# Altium schematic sheet Controller.SchDoc
size 297 x 209 mm; SheetNumber: 2; SheetTotal: 4
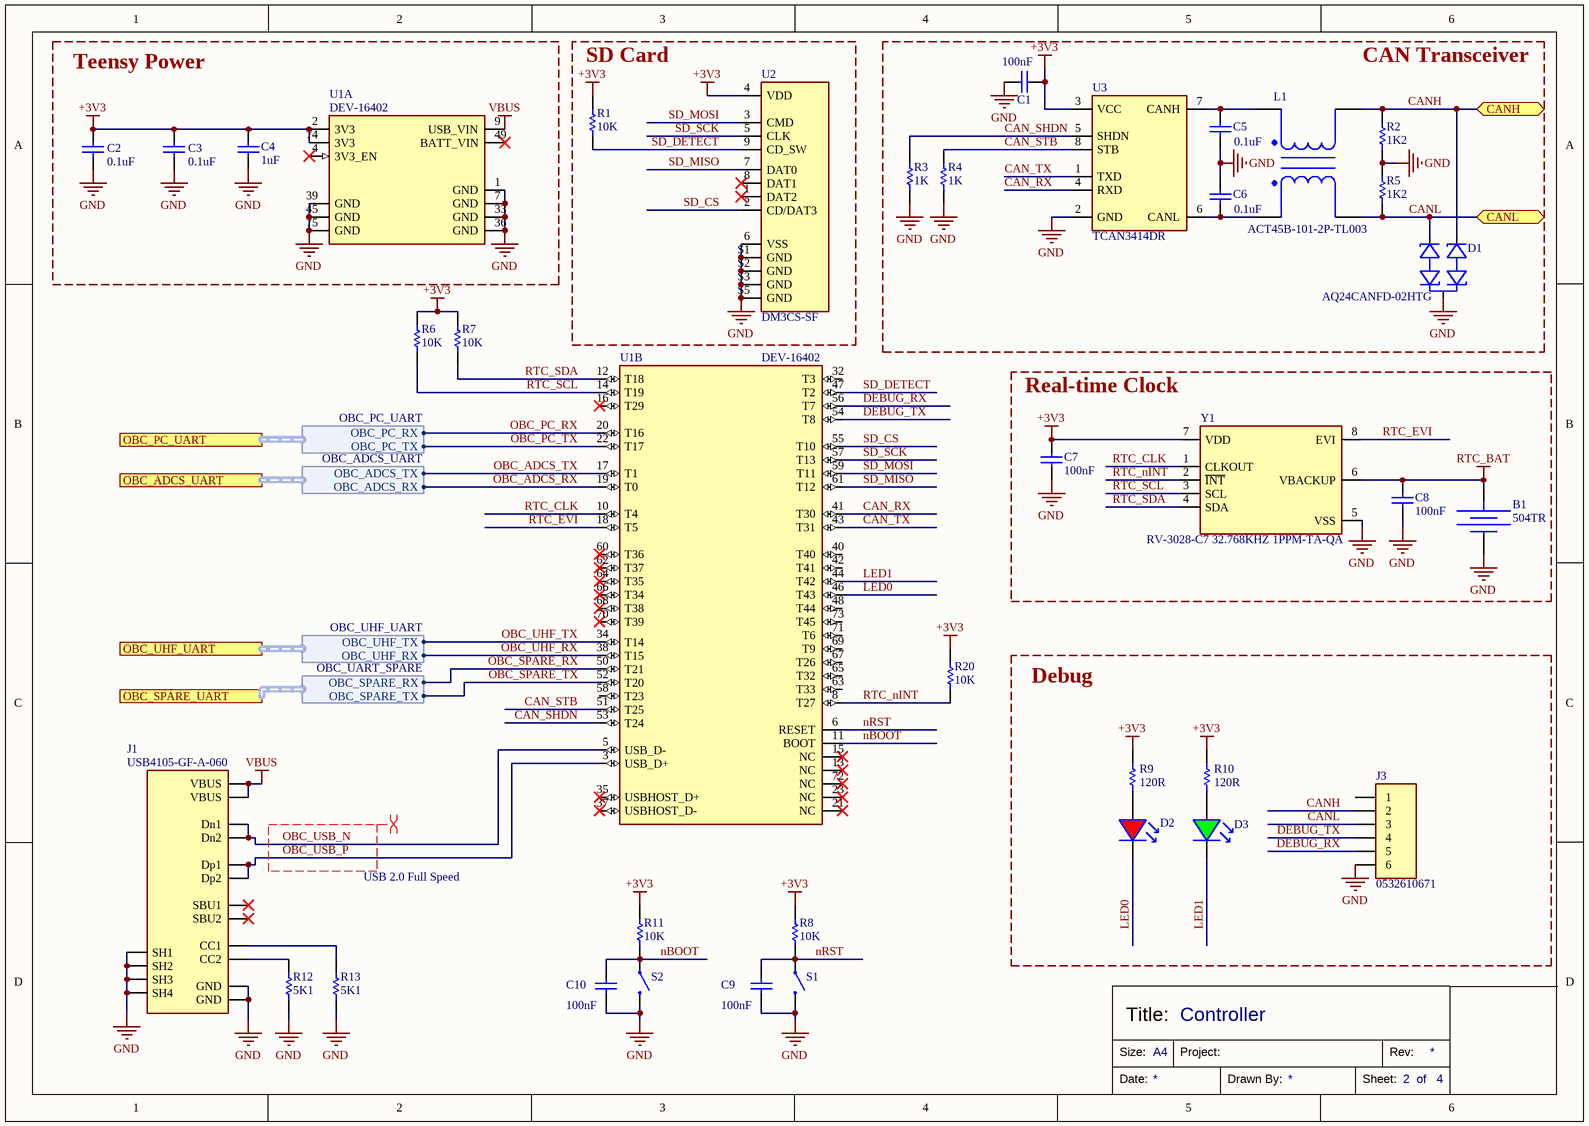
[diagram p0: Controller.SchDoc]

## Parts
B1  504TR  [504TR]
C1  Capacitance: 100nF  [CAPC0603X040]  (hidden comment: C0603C104K5RACTU)
C2  Capacitance: 0.1uF  [CAPC0402X020]  (hidden comment: CL05B104KB5NNNC)
C3  Capacitance: 0.1uF  [CAPC0402X020]  (hidden comment: CL05B104KB5NNNC)
C4  Capacitance: 1uF  [CAPC0805X060]  (hidden comment: CL21B105KAFNNNE)
C5  Capacitance: 0.1uF  [CAPC0402X020]  (hidden comment: CL05B104KB5NNNC)
C6  Capacitance: 0.1uF  [CAPC0402X020]  (hidden comment: CL05B104KB5NNNC)
C7  Capacitance: 100nF  [CAPC0603X040]  (hidden comment: C0603C104K5RACTU)
C8  Capacitance: 100nF  [CAPC0603X040]  (hidden comment: C0603C104K5RACTU)
C9  Capacitance: 100nF  [CAPC0603X040]  (hidden comment: C0603C104K5RACTU)
C10  Capacitance: 100nF  [CAPC0603X040]  (hidden comment: C0603C104K5RACTU)
D1  AQ24CANFD-02HTG  [SOT23-3 IC]
D2  LTST-C171KRKT  [LEDR_0805]  (value not drawn)
D3  LTST-C171KGKT  [LEDG_0805]  (value not drawn)
J1  USB4105-GF-A-060  [USB4105-GF-A-060]
J3  0532610671  [0532610671]
L1  ACT45B-101-2P-TL003  [ACT45B-101-2P-TL003]
R1  Resistance: 10K  [RESC0805]  (hidden comment: RMCF0805FT10K0)
R2  Resistance: 1K2  [RESC0603]  (hidden comment: RMCF0603FT1K20)
R3  Resistance: 1K  [RESC0805]  (hidden comment: RNCP0805FTD1K00)
R4  Resistance: 1K  [RESC0805]  (hidden comment: RNCP0805FTD1K00)
R5  Resistance: 1K2  [RESC0603]  (hidden comment: RMCF0603FT1K20)
R6  Resistance: 10K  [RESC0603]  (hidden comment: RMCF0603FT10K0)
R7  Resistance: 10K  [RESC0603]  (hidden comment: RMCF0603FT10K0)
R8  Resistance: 10K  [RESC0805]  (hidden comment: RMCF0805FT10K0)
R9  Resistance: 120R  [RESC0805]  (hidden comment: RMCF0805FT120R)
R10  Resistance: 120R  [RESC0805]  (hidden comment: RMCF0805FT120R)
R11  Resistance: 10K  [RESC0805]  (hidden comment: RMCF0805FT10K0)
R12  Resistance: 5K1  [RESC0603]  (hidden comment: RMCF0603FT5K10)
R13  Resistance: 5K1  [RESC0603]  (hidden comment: RMCF0603FT5K10)
R20  Resistance: 10K  [RESC0603]  (hidden comment: RMCF0603FT10K0)
S1  B3U-1000P  [B3U-1000P]  (value not drawn)
S2  B3U-1000P  [B3U-1000P]  (value not drawn)
U1  DEV-16402  [DEV-16402]  (parts A,B of 2)
U2  DM3CS-SF  [DM3CS-SF]
U3  TCAN3414DR  [SOIC-8]
Y1  RV-3028-C7 32.768KHZ 1PPM-TA-QA  [RV-3028]

## Blocks framed on the sheet
Teensy Power: C2-C4 U1
SD Card: R1 U2
CAN Transceiver: C1 C5 C6 D1 L1 R2-R5 U3
Real-time Clock: B1 C7 C8 Y1
Debug: D2 D3 J3 R9 R10

## Ports
CANH (bidir, see PC104[1B]), CANL (bidir, see PC104[1B]), OBC_ADCS_UART (harness OBC_ADCS_UART, see PC104[1B]), OBC_PC_UART (harness OBC_PC_UART, see PC104[4B]), OBC_SPARE_UART (harness OBC_UART_SPARE, see PC104[4A]), OBC_UHF_UART (harness OBC_UHF_UART, see PC104[1C])

## Harnesses
OBC_ADCS_UART: OBC_ADCS_TX, OBC_ADCS_RX
OBC_PC_UART: OBC_PC_TX, OBC_PC_RX
OBC_UHF_UART: OBC_UHF_TX, OBC_UHF_RX
OBC_UART_SPARE: OBC_SPARE_TX, OBC_SPARE_RX

## Nets
+3V3: C1.2 C2.2 C3.2 C4.2 C7.2 R1.2 R6.2 R7.2 R8.2 R9.2 R10.2 R11.2 R20.2 U1.2(3V3) U1.74(3V3) U2.4(VDD) U3.3(VCC) Y1.7(VDD)
GND: B1.2 C1.1 C2.1 C3.1 C4.1 C5.1 C6.2 C7.1 C8.1 C9.1 C10.1 D1.3 J1.A1_B12(GND) J1.B1_A12(GND) J1.SH1 J1.SH2 J1.SH3 J1.SH4 J3.6 R2.1 R3.1 R4.1 R5.2 R12.1 R13.1 S1.2 S2.2 U1.1(GND) U1.7(GND) U1.33(GND) U1.36(GND) U1.39(GND) U1.45(GND) U1.75(GND) U2.6(VSS) U2.S1(GND) U2.S2(GND) U2.S3(GND) U2.S5(GND) U3.2(GND) Y1.5(VSS)
RTC_BAT: B1.1 C8.2 Y1.6(VBACKUP)
VBUS: J1.A4_B9(VBUS) J1.B4_A9(VBUS) U1.9(USB_VIN)
CAN_RX: U1.41(T30) U3.4(RXD)
CAN_SHDN: R3.2 U1.53(T24) U3.5(SHDN)
CAN_STB: R4.2 U1.51(T25) U3.8(STB)
CAN_TX: U1.43(T31) U3.1(TXD)
CANH: D1.1 J3.2 L1.4 R2.2 ; port CANH
CANL: D1.2 J3.3 L1.3 R5.1 ; port CANL
DEBUG_RX: J3.5 U1.56(T7)
DEBUG_TX: J3.4 U1.54(T8)
LED0: D2.K U1.46(T43)
LED1: D3.K U1.44(T42)
nBOOT: C10.2 R11.1 S2.1 U1.11(BOOT)
nRST: C9.2 R8.1 S1.1 U1.6(RESET)
OBC_ADCS_RX: U1.19(T0) ; port OBC_ADCS_UART.OBC_ADCS_RX
OBC_ADCS_TX: U1.17(T1) ; port OBC_ADCS_UART.OBC_ADCS_TX
OBC_PC_RX: U1.20(T16) ; port OBC_PC_UART.OBC_PC_RX
OBC_PC_TX: U1.22(T17) ; port OBC_PC_UART.OBC_PC_TX
OBC_SPARE_RX: U1.50(T21) ; port OBC_SPARE_UART.OBC_SPARE_RX
OBC_SPARE_TX: U1.52(T20) ; port OBC_SPARE_UART.OBC_SPARE_TX
OBC_UHF_RX: U1.38(T15) ; port OBC_UHF_UART.OBC_UHF_RX
OBC_UHF_TX: U1.34(T14) ; port OBC_UHF_UART.OBC_UHF_TX
OBC_USB_N: J1.A7(Dn1) J1.B7(Dn2) U1.5(USB_D-)
OBC_USB_P: J1.A6(Dp1) J1.B6(Dp2) U1.3(USB_D+)
RTC_CLK: U1.10(T4) Y1.1(CLKOUT)
RTC_EVI: U1.18(T5) Y1.8(EVI)
RTC_nINT: R20.1 U1.8(T27) Y1.2(~{INT})
RTC_SCL: R6.1 U1.14(T19) Y1.3(SCL)
RTC_SDA: R7.1 U1.12(T18) Y1.4(SDA)
SD_CS: U1.55(T10) U2.2(CD/DAT3)
SD_DETECT: R1.1 U1.47(T2) U2.9(CD_SW)
SD_MISO: U1.61(T12) U2.7(DAT0)
SD_MOSI: U1.59(T11) U2.3(CMD)
SD_SCK: U1.57(T13) U2.5(CLK)
NetC5_2: C5.2 L1.1 U3.7(CANH)
NetC6_1: C6.1 L1.2 U3.6(CANL)
NetD2_A: D2.A R9.1
NetD3_A: D3.A R10.1
NetJ1_A5: J1.A5(CC1) R13.2
NetJ1_B5: J1.B5(CC2) R12.2

Not connected (* = marked no-connect by the designer): J1 A8(SBU1)* B8(SBU2)*; J3 1; U1 4(3V3_EN)* 13(NC)* 15(NC)* 16(T29)* 21(NC)* 23(NC)* 32(T3) 35(USBHOST_D+)* 37(USBHOST_D-)* 40(T40) 42(T41) 48(T44) 49(BATT_VIN)* 58(T23) 60(T36)* 62(T37)* 63(T33) 64(T35)* 65(T32) 66(T34)* 67(T26) 68(T38)* 69(T9) 70(T39)* 71(T6) 72(NC)* 73(T45); U2 1(DAT2)* 8(DAT1)*

## Layout directives
differential pair: OBC_USB_N, OBC_USB_P

## Notes on the sheet
- (near J1) USB 2.0 Full Speed
- Controller
- Size:
- Title:
- A4
- Project:
- Rev:
- Date:
- Drawn By:
- Sheet:
- of

## Library data of the parts
B1 = 504TR: Battery Holder (Open) Coin, 16.0mm 1 Cell SMD (SMT) Tab; Base Material: LCP UL94V-0; Battery Reference: ML621; Part Number: 504TR; Distributor Part Number: 36-504CT-ND; Operating Temperature: -50C to 145C
C1 C7-C10 = C0603C104K5RACTU: 0.1 µF ±10% 50V Ceramic Capacitor X7R 0603 (1608 Metric); Tolerance: 10%; Distributor Part Number: 399-C0603C104K5RACTUCT-ND; Case Code: 0603; Voltage Rating: 50V; Distributor: Digikey; Part Number: C0603C104K5RACTU
C2 C3 C5 C6 = CL05B104KB5NNNC: 0.1 µF ±10% 50V Ceramic Capacitor X7R 0402 (1005 Metric); Part Number: CL05B104KB5NNNC; Tolerance: 10%; Distributor Part Number: 1276-CL05B104KB5NNNCCT-ND; Case Code: 0402; Distributor: Digikey; Voltage Rating: 50V
C4 = CL21B105KAFNNNE: 1uF ±10% 25V Ceramic Capacitor X7R 0805 (2012 Metric); Part Number: CL21B105KAFNNNE; Distributor Part Number: 1276-1066-1-ND; Tolerance: 10%; Case Code: 0805; Distributor: Digikey; Voltage Rating: 25V
D1 = AQ24CANFD-02HTG: 50V Clamp 3A (8/20µs) Ipp Tvs Diode Surface Mount SOT-23-3; Qualification: AEC-Q101; Voltage - Reverse Standoff (Typ): 24V; Voltage - Breakdown (Min): 26.7V; Power - Peak Pulse: 200W; Capacitance: 11.5pF @ 1MHz; Part Number: AQ24CANFD-02HTG; Distributor Part Number: F10993CT-ND; Distributor: Digikey; Operating Temperature: -40°C ~ 150°C; Voltage - Clamping (Max): 50V; Current - Peak Pulse (10us/1000us): 3A
D2 = LTST-C171KRKT: Red 631nm LED Indication - Discrete 2V 0805 (2012 Metric); Distributor Part Number: 160-1427-1-ND; Colour: Red; Operating Temperature: -30℃~+85℃; Distributor: Digikey; Part Number: LTST-C171KRKT
D3 = KT-0805G: LED Green 0805 00mW 120° 2.6V~3.1V 430mcd 513nm~528nm 525nm 5mA; Distributor Part Number: 160-1426-1-ND; Colour: Green; Operating Temperature: -40℃~+85℃; Distributor: Digikey; Part Number: LTST-C171KGKT
J1 = USB4105-GF-A-060: USB-C (USB TYPE-C) USB 2.0 Receptacle Connector 24 (16+8 Dummy) Position Surface Mount, Right Angle; Through Hole; Specifications: USB 2.0; Voltage Rating: 48VDC; Current Rating: 5A; Part Number: USB4105-GF-A-060; Distributor: Digikey; Distributor Part Number: 2073-USB4105-GF-A-060CT-ND; Operating Temperature: -40C ~ 85C
J3 = 0532610671: Connector Header Surface Mount, Right Angle 6 position 0.049" (1.25mm) Picoblade; Number of Positions: 6; Contact Current (Max): 1A; Material Flammability Rating: UL94 V-0; Part Number: 0532610671; Distributor Part Number: WM7624CT-ND; Distributor: Digikey
L1 = ACT45B-101-2P-TL003: Common Mode Choke 100 µH @ 100 kHz 2 Line Surface Mount 5.8 kOhms @ 10 MHz 150mA DCR 2Ohm; Inductance: 100uH @ 100kHz; Voltage Rating (DC): 50V; Qualification: AEC-Q200; Part Number: ACT45B-101-2P-TL003; Distributor: Digikey; Distributor Part Number: 445-3959-1-ND; Impedance: 5.8kohms @ 10MHz; Current Rating (Max): 150mA; DCR: 2Ohm; Operating Temperature: -40°C ~ 150°C
R1 R8 R11 = RMCF0805FT10K0: 10 kOhms ±1% 0.125W, 1/8W Chip Resistor 0805 (2012 Metric) Automotive AEC-Q200 Thick Film; Tolerance: 1%; Distributor Part Number: RMCF0805FT10K0CT-ND; Case Code: 0805; Distributor: Digikey; Part Number: RMCF0805FT10K0
R2 R5 = RMCF0603FT1K20: 1.2 kOhms ±1% 0.1W, 1/10W Chip Resistor 0603 (1608 Metric) Automotive AEC-Q200 Thick Film; Part Number: RMCF0603FT1K20; Tolerance: 1%; Distributor: Digikey; Distributor Part Number: RMCF0603FT1K20CT-ND; Case Code: 0603
R3 R4 = RNCP0805FTD1K00: 1 kOhms ±1% 0.25W, 1/4W Chip Resistor 0805 (2012 Metric) Anti-Sulfur Thin Film; Manufacturer Part Number: RNCP0805FTD1K00; Tolerance: 1%; Distributor Part Number: RNCP0805FTD1K00CT-ND; Distributor: Digikey; Case Code: 0805
R6 R7 R20 = RMCF0603FT10K0: 10 kOhms ±1% 0.1W, 1/10W Chip Resistor 0603 (1608 Metric) Automotive AEC-Q200 Thick Film; Part Number: RMCF0603FT10K0; Tolerance: 1%; Distributor Part Number: RMCF0603FT10K0CT-ND; Distributor: Digikey; Case Code: 0603
R9 R10 = RMCF0805FT120R: 120 Ohms ±1% 0.125W, 1/8W Chip Resistor 0805 (2012 Metric) Automotive AEC-Q200 Thick Film; Part Number: RMCF0805FT120R; Tolerance: 1%; Distributor Part Number: 738-RMCF0805FT120RCT-ND; Distributor: Digikey; Case Code: 0805
R12 R13 = RMCF0603FT5K10: 5.1 kOhms ±1% 0.1W, 1/10W Chip Resistor 0603 (1608 Metric) Automotive AEC-Q200 Thick Film; Part Number: RMCF0603FT5K10; Tolerance: 1%; Distributor: Digikey; Distributor Part Number: RMCF0603FT5K10CT-ND; Case Code: 0603
S1 S2 = B3U-1000P: Tactile Switch SPST-NO Top Actuated Surface Mount; Part Number: B3U-1000P; Distributor: Digikey; Distributor Part Number: SW1020CT-ND; Operating Temperature: -25°C ~ 70°C
U1 = DEV-16402: SparkFun DEV-16402 MicroMod Teensy Processor, 22x22 mm pluggable processor module, NXP i.MX RT1062 Cortex-M7 @ 600 MHz, 16 MB Flash, 1 MB RAM, MicroMod M.2 edge connector, 3.3 V system.; Processor Speed: 600MHz; Flash Memory: 16MB; RAM: 1MB; Part Number: DEV-16402; Distributor: Digikey; Distributor Part Number: 1568-16402-ND
U2 = DM3CS-SF: 10 (8 + 2) Position Card Connector Secure Digital - microSD™ Surface Mount, Right Angle Gold; Part Number: DM3CS-SF; Distributor: Digikey; Distributor Part Number: HR1972CT-ND
U3 = TCAN3414DR: 3.3 V CAN-FD transceiver, CAN/CAN-FD up to 8 Mb/s, ±58 V bus-fault tolerant, SOIC-8; Voltage - Supply: 3V ~ 3.6V; Data Rate: 8Mbps; Protocol: CANbus; Part Number: TCAN3414DR; Distributor: Digikey; Distributor Part Number: 296-TCAN3414DRCT-ND; Operating Temperature: -40°C ~ 125°C
Y1 = RV-3028-C7 32.768KHZ 1PPM-TA-QA: Real Time Clock (RTC) IC Clock/Calendar 2B, 43B I2C, 2-Wire Serial 8-WCDFN; Voltage - Supply: 1.1V ~ 5.5V; Current - Timekeeping: 0.06µA @ 3V; Part Number: RV-3028-C7 32.768KHZ 1PPM-TA-QA; Distributor: Digikey; Distributor Part Number: 2195-RV-3028-C732.768KHZ1PPM-TA-QACT-ND; Operating Temperature: -40°C ~ 85°C